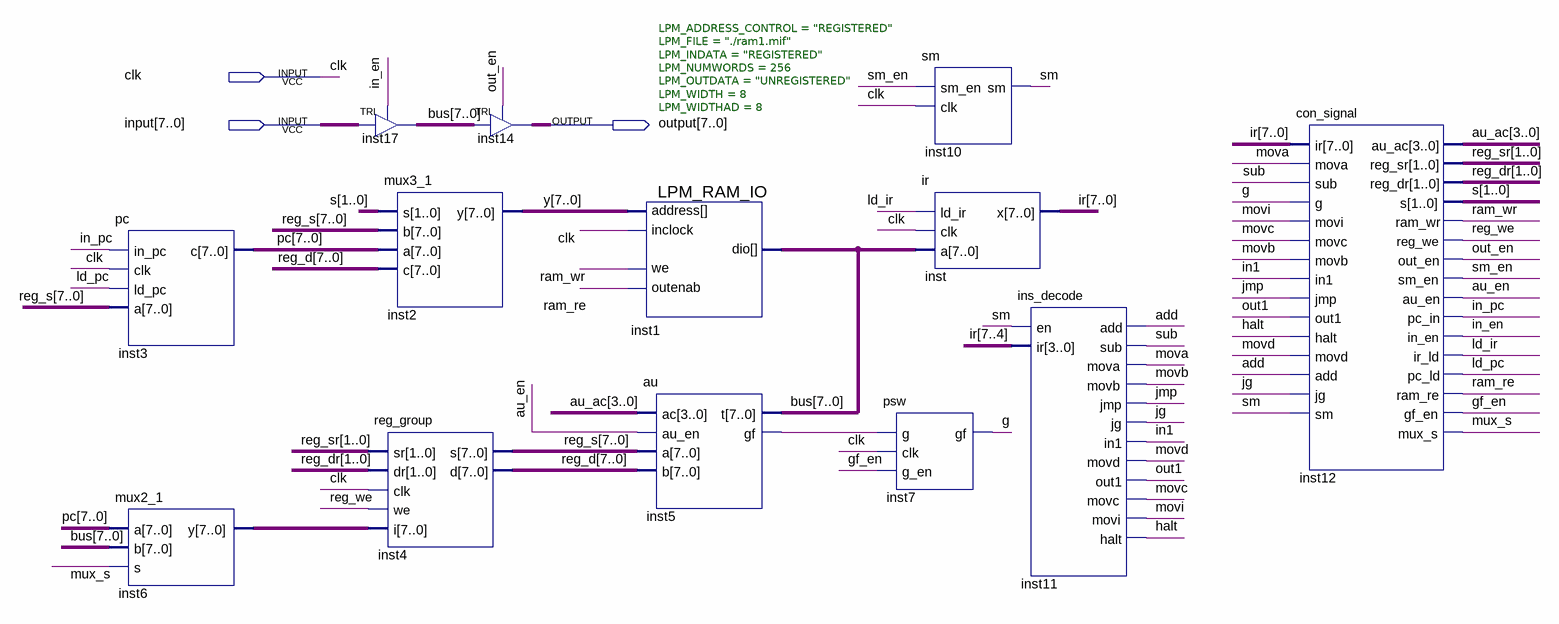
[diagram p0: schematic sheet]
// Quartus schematic small_computer.bdf as structural Verilog: 13 symbols, 3 pins
module small_computer (
  input  clk,
  input  [7:0] \input ,
  output [7:0] \output 
);

  wire add, au_en, g, gf_en, halt, in1, in_en, in_pc, inst5_gf, jg, jmp, ld_ir, ld_pc, mova, movb, movc,
       movd, movi, mux_s, out1, out_en, ram_re, ram_wr, reg_we, sm, sm_en, sub;
  wire [1:0] reg_dr, reg_sr, s;
  wire [3:0] au_ac;
  wire [7:0] bus, inst6_y, ir, pc, reg_d, reg_s, y;

  pc inst3 (.in_pc(in_pc), .clk(clk), .ld_pc(ld_pc), .a(reg_s), .c(pc));
  mux2_1 inst6 (.a(pc), .b(bus), .s(mux_s), .y(inst6_y));
  TRI inst17[7:0] (.IN(\input ), .OE(in_en), .OUT(bus));
  mux3_1 inst2 (.s(s), .b(reg_s), .a(pc), .c(reg_d), .y(y));
  reg_group inst4 (.sr(reg_sr), .dr(reg_dr), .clk(clk), .we(reg_we), .i(inst6_y), .s(reg_s), .d(reg_d));
  TRI inst14[7:0] (.IN(bus), .OE(out_en), .OUT(\output ));
  LPM_RAM_IO #(.LPM_ADDRESS_CONTROL("REGISTERED"), .LPM_FILE("./ram1.mif"), .LPM_INDATA("REGISTERED"), .LPM_NUMWORDS(256), .LPM_OUTDATA("UNREGISTERED"), .LPM_WIDTH(8), .LPM_WIDTHAD(8)) inst1 (
    .address(y), .inclock(clk), .we(ram_wr), .outenab(ram_re), .dio(bus));
  au inst5 (.ac(au_ac), .au_en(au_en), .a(reg_s), .b(reg_d), .t(bus), .gf(inst5_gf));
  sm inst10 (.sm_en(sm_en), .clk(clk), .sm(sm));
  ir inst (.ld_ir(ld_ir), .clk(clk), .a(bus), .x(ir));
  psw inst7 (.g(inst5_gf), .clk(clk), .g_en(gf_en), .gf(g));
  ins_decode inst11 (
    .en(sm), .ir(ir[7:4]), .add(add), .sub(sub), .mova(mova), .movb(movb), .jmp(jmp), .jg(jg), .in1(in1),
    .movd(movd), .out1(out1), .movc(movc), .movi(movi), .halt(halt));
  con_signal inst12 (
    .ir(ir), .mova(mova), .sub(sub), .g(g), .movi(movi), .movc(movc), .movb(movb), .in1(in1), .jmp(jmp),
    .out1(out1), .halt(halt), .movd(movd), .add(add), .jg(jg), .sm(sm), .au_ac(au_ac), .reg_sr(reg_sr),
    .reg_dr(reg_dr), .s(s), .ram_wr(ram_wr), .reg_we(reg_we), .out_en(out_en), .sm_en(sm_en), .au_en(au_en),
    .pc_in(in_pc), .in_en(in_en), .ir_ld(ld_ir), .pc_ld(ld_pc), .ram_re(ram_re), .gf_en(gf_en), .mux_s(mux_s));
endmodule
